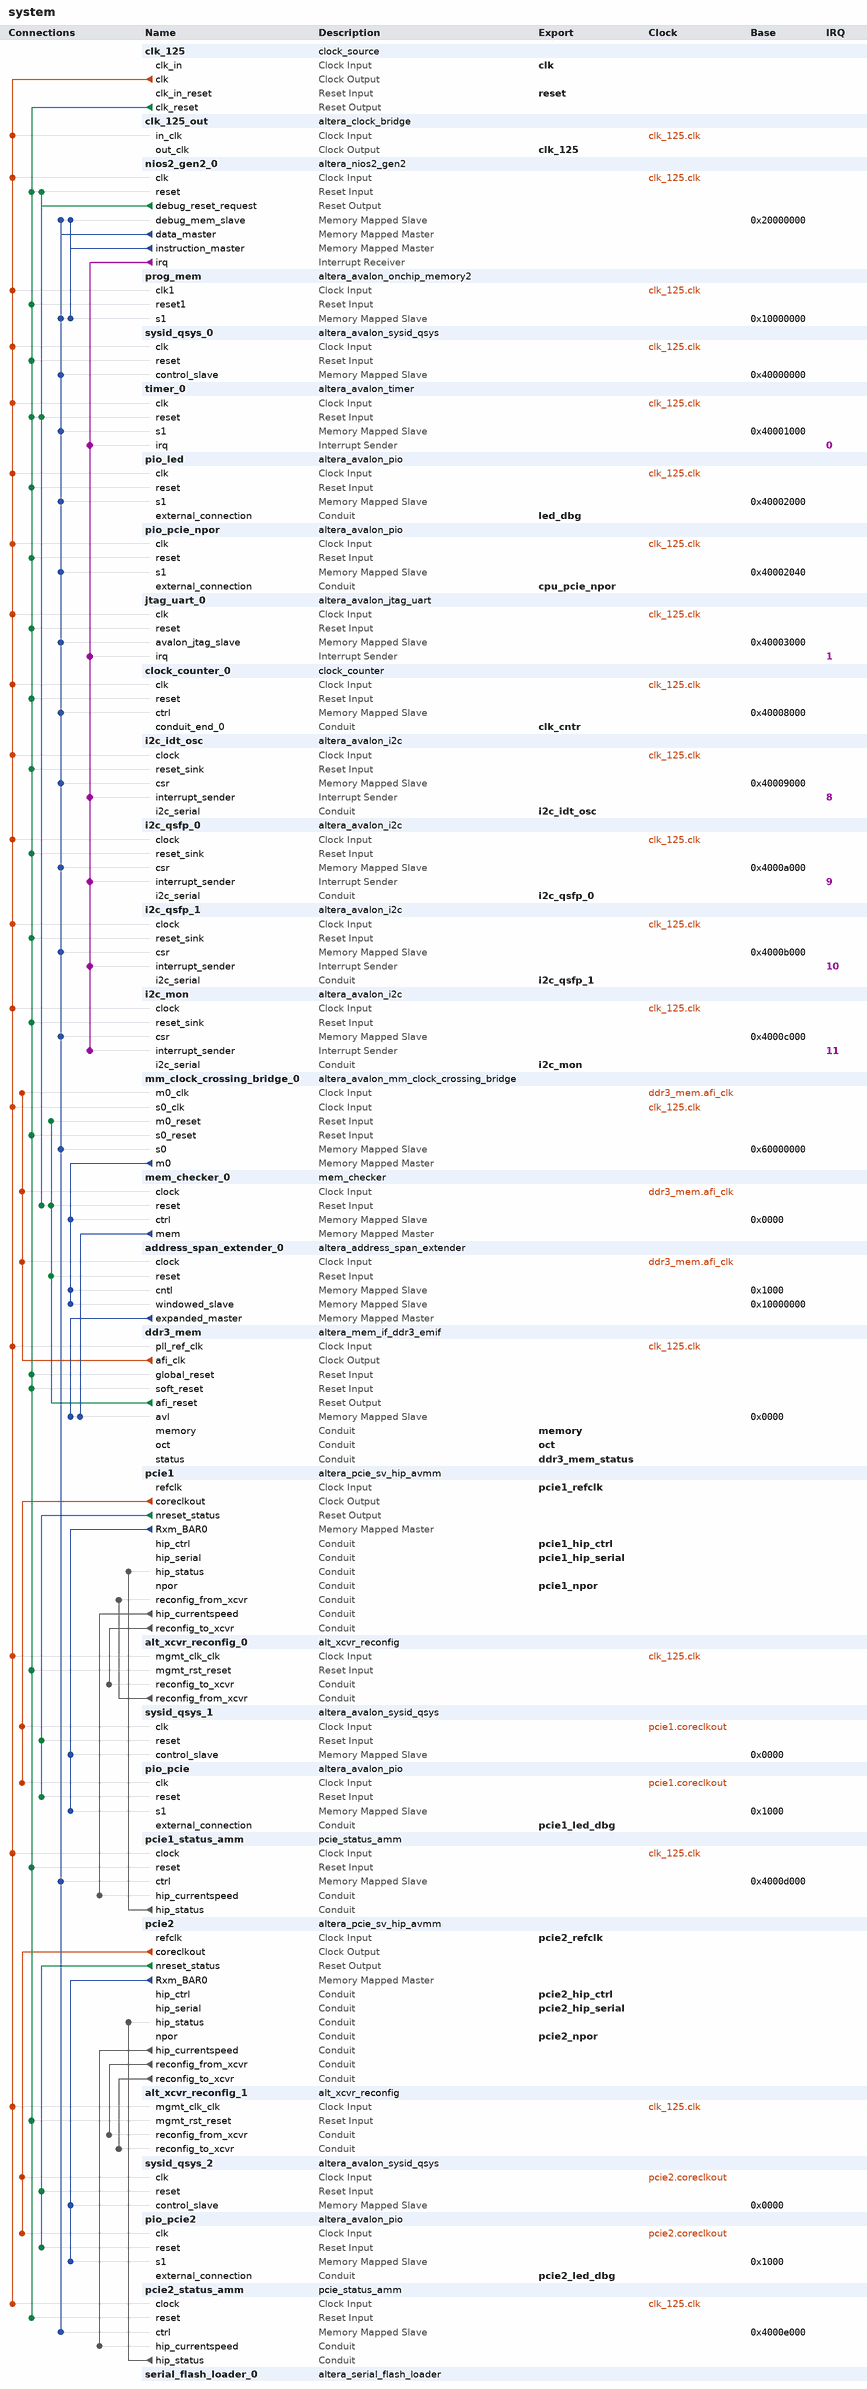
[diagram p0: system contents]
# Platform Designer (Qsys) system system, Stratix V 5SGSMD5K1F40C1
# Parameters at their usual value, and those the tool derives, are not listed.
package require -exact qsys 18.1
create_system system
set_project_property DEVICE_FAMILY {Stratix V}
set_project_property DEVICE 5SGSMD5K1F40C1

add_instance clk_125 clock_source 18.1
set_instance_parameter_value clk_125 clockFrequency 125000000

add_instance clk_125_out altera_clock_bridge 18.1
set_instance_parameter_value clk_125_out DERIVED_CLOCK_RATE 125000000
set_instance_parameter_value clk_125_out EXPLICIT_CLOCK_RATE 0

add_instance nios2_gen2_0 altera_nios2_gen2 18.1
set_instance_parameter_value nios2_gen2_0 dcache_size 2048
set_instance_parameter_value nios2_gen2_0 exceptionSlave prog_mem.s1
set_instance_parameter_value nios2_gen2_0 icache_size 4096
set_instance_parameter_value nios2_gen2_0 impl Tiny
set_instance_parameter_value nios2_gen2_0 resetSlave prog_mem.s1

add_instance prog_mem altera_avalon_onchip_memory2 18.1
set_instance_parameter_value prog_mem dataWidth 32
set_instance_parameter_value prog_mem dualPort false
set_instance_parameter_value prog_mem initMemContent true
set_instance_parameter_value prog_mem initializationFileName onchip_mem.hex
set_instance_parameter_value prog_mem memorySize 98304

add_instance sysid_qsys_0 altera_avalon_sysid_qsys 18.1
set_instance_parameter_value sysid_qsys_0 id 121286663

add_instance timer_0 altera_avalon_timer 18.1
set_instance_parameter_value timer_0 period 1
set_instance_parameter_value timer_0 periodUnits MSEC

add_instance pio_led altera_avalon_pio 18.1
set_instance_parameter_value pio_led direction Output
set_instance_parameter_value pio_led width 2

add_instance pio_pcie_npor altera_avalon_pio 18.1
set_instance_parameter_value pio_pcie_npor direction Output
set_instance_parameter_value pio_pcie_npor resetValue 1
set_instance_parameter_value pio_pcie_npor width 1

add_instance jtag_uart_0 altera_avalon_jtag_uart 18.1
set_instance_parameter_value jtag_uart_0 simInteractiveOptions NO_INTERACTIVE_WINDOWS

add_instance clock_counter_0 clock_counter 1.0
set_instance_parameter_value clock_counter_0 CLK_FREQ 125000000

add_instance i2c_idt_osc altera_avalon_i2c 18.1
set_instance_parameter_value i2c_idt_osc FIFO_DEPTH 32

add_instance i2c_qsfp_0 altera_avalon_i2c 18.1
set_instance_parameter_value i2c_qsfp_0 FIFO_DEPTH 32

add_instance i2c_qsfp_1 altera_avalon_i2c 18.1
set_instance_parameter_value i2c_qsfp_1 FIFO_DEPTH 32

add_instance i2c_mon altera_avalon_i2c 18.1
set_instance_parameter_value i2c_mon FIFO_DEPTH 32

add_instance mm_clock_crossing_bridge_0 altera_avalon_mm_clock_crossing_bridge 18.1
set_instance_parameter_value mm_clock_crossing_bridge_0 ADDRESS_WIDTH 29
set_instance_parameter_value mm_clock_crossing_bridge_0 COMMAND_FIFO_DEPTH 4
set_instance_parameter_value mm_clock_crossing_bridge_0 DATA_WIDTH 32
set_instance_parameter_value mm_clock_crossing_bridge_0 MASTER_SYNC_DEPTH 2
set_instance_parameter_value mm_clock_crossing_bridge_0 MAX_BURST_SIZE 1
set_instance_parameter_value mm_clock_crossing_bridge_0 RESPONSE_FIFO_DEPTH 4
set_instance_parameter_value mm_clock_crossing_bridge_0 SLAVE_SYNC_DEPTH 2
set_instance_parameter_value mm_clock_crossing_bridge_0 USE_AUTO_ADDRESS_WIDTH 0

add_instance mem_checker_0 mem_checker 1.0

add_instance address_span_extender_0 altera_address_span_extender 18.1
set_instance_parameter_value address_span_extender_0 BURSTCOUNT_WIDTH 1
set_instance_parameter_value address_span_extender_0 DATA_WIDTH 512
set_instance_parameter_value address_span_extender_0 ENABLE_SLAVE_PORT true
set_instance_parameter_value address_span_extender_0 MASTER_ADDRESS_DEF 0
set_instance_parameter_value address_span_extender_0 MAX_PENDING_READS 1
set_instance_parameter_value address_span_extender_0 SLAVE_ADDRESS_WIDTH 22

add_instance ddr3_mem altera_mem_if_ddr3_emif 18.1
set_instance_parameter_value ddr3_mem AVL_MAX_SIZE 64
set_instance_parameter_value ddr3_mem CALIBRATION_MODE Quick
set_instance_parameter_value ddr3_mem CFG_REORDER_DATA false
set_instance_parameter_value ddr3_mem CPORT_TYPE_PORT Bidirectional,Bidirectional,Bidirectional,Bidirectional,Bidirectional,Bidirectional
set_instance_parameter_value ddr3_mem CTL_CSR_ENABLED true
set_instance_parameter_value ddr3_mem CTL_ECC_AUTO_CORRECTION_ENABLED true
set_instance_parameter_value ddr3_mem CTL_ECC_ENABLED true
set_instance_parameter_value ddr3_mem EXPORT_AFI_HALF_CLK false
set_instance_parameter_value ddr3_mem HARD_EMIF false
set_instance_parameter_value ddr3_mem MEM_BANKADDR_WIDTH 3
set_instance_parameter_value ddr3_mem MEM_CLK_FREQ 800.0
set_instance_parameter_value ddr3_mem MEM_CLK_FREQ_MAX 1066.667
set_instance_parameter_value ddr3_mem MEM_COL_ADDR_WIDTH 10
set_instance_parameter_value ddr3_mem MEM_DQ_WIDTH 72
set_instance_parameter_value ddr3_mem MEM_DRV_STR RZQ/6
set_instance_parameter_value ddr3_mem MEM_FORMAT DISCRETE
set_instance_parameter_value ddr3_mem MEM_ROW_ADDR_WIDTH 16
set_instance_parameter_value ddr3_mem MEM_RTT_NOM RZQ/4
set_instance_parameter_value ddr3_mem MEM_RTT_WR RZQ/2
set_instance_parameter_value ddr3_mem MEM_TCL 11
set_instance_parameter_value ddr3_mem MEM_TFAW_NS 30.0
set_instance_parameter_value ddr3_mem MEM_TRAS_NS 37.5
set_instance_parameter_value ddr3_mem MEM_TRCD_NS 13.75
set_instance_parameter_value ddr3_mem MEM_TRFC_NS 260.0
set_instance_parameter_value ddr3_mem MEM_TRP_NS 13.75
set_instance_parameter_value ddr3_mem MEM_TRRD_NS 6.25
set_instance_parameter_value ddr3_mem MEM_TRTP_NS 7.5
set_instance_parameter_value ddr3_mem MEM_TWTR 6
set_instance_parameter_value ddr3_mem MEM_VENDOR Hynix
set_instance_parameter_value ddr3_mem MEM_VOLTAGE {1.35V DDR3L}
set_instance_parameter_value ddr3_mem MEM_WTCL 8
set_instance_parameter_value ddr3_mem PLL_LOCATION Top_Bottom
set_instance_parameter_value ddr3_mem POWER_OF_TWO_BUS true
set_instance_parameter_value ddr3_mem PRIORITY_PORT 1,1,1,1,1,1
set_instance_parameter_value ddr3_mem RATE Quarter
set_instance_parameter_value ddr3_mem REF_CLK_FREQ 125.0
set_instance_parameter_value ddr3_mem SPEED_GRADE 2
set_instance_parameter_value ddr3_mem TIMING_BOARD_AC_SKEW 0.02
set_instance_parameter_value ddr3_mem TIMING_BOARD_AC_TO_CK_SKEW 0.0
set_instance_parameter_value ddr3_mem TIMING_BOARD_DQ_TO_DQS_SKEW 0.0
set_instance_parameter_value ddr3_mem TIMING_BOARD_MAX_CK_DELAY 0.6
set_instance_parameter_value ddr3_mem TIMING_BOARD_MAX_DQS_DELAY 0.6
set_instance_parameter_value ddr3_mem TIMING_BOARD_SKEW_BETWEEN_DQS 0.02
set_instance_parameter_value ddr3_mem TIMING_BOARD_SKEW_CKDQS_DIMM_MAX 0.01
set_instance_parameter_value ddr3_mem TIMING_BOARD_SKEW_CKDQS_DIMM_MIN -0.01
set_instance_parameter_value ddr3_mem TIMING_BOARD_SKEW_WITHIN_DQS 0.02
set_instance_parameter_value ddr3_mem TIMING_TDH 110
set_instance_parameter_value ddr3_mem TIMING_TDQSCK 225
set_instance_parameter_value ddr3_mem TIMING_TDQSQ 150
set_instance_parameter_value ddr3_mem TIMING_TDQSS 0.25
set_instance_parameter_value ddr3_mem TIMING_TDS 40
set_instance_parameter_value ddr3_mem TIMING_TDSH 0.2
set_instance_parameter_value ddr3_mem TIMING_TDSS 0.2
set_instance_parameter_value ddr3_mem TIMING_TIH 210
set_instance_parameter_value ddr3_mem TIMING_TIS 140
set_instance_parameter_value ddr3_mem TIMING_TQSH 0.4
set_instance_parameter_value ddr3_mem USER_DEBUG_LEVEL 1

add_instance pcie1 altera_pcie_sv_hip_avmm 18.1
set_instance_parameter_value pcie1 AST_LITE 0
set_instance_parameter_value pcie1 AVALON_ADDR_WIDTH 32
set_instance_parameter_value pcie1 AddressPage "0\\,1\\,2\\,3\\,4\\,5\\,6\\,7\\,8\\,9\\,10\\,11\\,12\\,13\\,14\\,15"
set_instance_parameter_value pcie1 BYPASSS_A2P_TRANSLATION 0
set_instance_parameter_value pcie1 CB_A2P_ADDR_MAP_FIXED_TABLE_0_HIGH 0
set_instance_parameter_value pcie1 CB_A2P_ADDR_MAP_FIXED_TABLE_0_LOW 0
set_instance_parameter_value pcie1 CB_A2P_ADDR_MAP_FIXED_TABLE_10_HIGH 0
set_instance_parameter_value pcie1 CB_A2P_ADDR_MAP_FIXED_TABLE_10_LOW 0
set_instance_parameter_value pcie1 CB_A2P_ADDR_MAP_FIXED_TABLE_11_HIGH 0
set_instance_parameter_value pcie1 CB_A2P_ADDR_MAP_FIXED_TABLE_11_LOW 0
set_instance_parameter_value pcie1 CB_A2P_ADDR_MAP_FIXED_TABLE_12_HIGH 0
set_instance_parameter_value pcie1 CB_A2P_ADDR_MAP_FIXED_TABLE_12_LOW 0
set_instance_parameter_value pcie1 CB_A2P_ADDR_MAP_FIXED_TABLE_13_HIGH 0
set_instance_parameter_value pcie1 CB_A2P_ADDR_MAP_FIXED_TABLE_13_LOW 0
set_instance_parameter_value pcie1 CB_A2P_ADDR_MAP_FIXED_TABLE_14_HIGH 0
set_instance_parameter_value pcie1 CB_A2P_ADDR_MAP_FIXED_TABLE_14_LOW 0
set_instance_parameter_value pcie1 CB_A2P_ADDR_MAP_FIXED_TABLE_15_HIGH 0
set_instance_parameter_value pcie1 CB_A2P_ADDR_MAP_FIXED_TABLE_15_LOW 0
set_instance_parameter_value pcie1 CB_A2P_ADDR_MAP_FIXED_TABLE_1_HIGH 0
set_instance_parameter_value pcie1 CB_A2P_ADDR_MAP_FIXED_TABLE_1_LOW 0
set_instance_parameter_value pcie1 CB_A2P_ADDR_MAP_FIXED_TABLE_2_HIGH 0
set_instance_parameter_value pcie1 CB_A2P_ADDR_MAP_FIXED_TABLE_2_LOW 0
set_instance_parameter_value pcie1 CB_A2P_ADDR_MAP_FIXED_TABLE_3_HIGH 0
set_instance_parameter_value pcie1 CB_A2P_ADDR_MAP_FIXED_TABLE_3_LOW 0
set_instance_parameter_value pcie1 CB_A2P_ADDR_MAP_FIXED_TABLE_4_HIGH 0
set_instance_parameter_value pcie1 CB_A2P_ADDR_MAP_FIXED_TABLE_4_LOW 0
set_instance_parameter_value pcie1 CB_A2P_ADDR_MAP_FIXED_TABLE_5_HIGH 0
set_instance_parameter_value pcie1 CB_A2P_ADDR_MAP_FIXED_TABLE_5_LOW 0
set_instance_parameter_value pcie1 CB_A2P_ADDR_MAP_FIXED_TABLE_6_HIGH 0
set_instance_parameter_value pcie1 CB_A2P_ADDR_MAP_FIXED_TABLE_6_LOW 0
set_instance_parameter_value pcie1 CB_A2P_ADDR_MAP_FIXED_TABLE_7_HIGH 0
set_instance_parameter_value pcie1 CB_A2P_ADDR_MAP_FIXED_TABLE_7_LOW 0
set_instance_parameter_value pcie1 CB_A2P_ADDR_MAP_FIXED_TABLE_8_HIGH 0
set_instance_parameter_value pcie1 CB_A2P_ADDR_MAP_FIXED_TABLE_8_LOW 0
set_instance_parameter_value pcie1 CB_A2P_ADDR_MAP_FIXED_TABLE_9_HIGH 0
set_instance_parameter_value pcie1 CB_A2P_ADDR_MAP_FIXED_TABLE_9_LOW 0
set_instance_parameter_value pcie1 CB_A2P_ADDR_MAP_IS_FIXED 0
set_instance_parameter_value pcie1 CB_A2P_ADDR_MAP_NUM_ENTRIES 2
set_instance_parameter_value pcie1 CB_A2P_ADDR_MAP_PASS_THRU_BITS 20
set_instance_parameter_value pcie1 CB_P2A_AVALON_ADDR_B0 0x00000000
set_instance_parameter_value pcie1 CB_P2A_AVALON_ADDR_B1 0x00000000
set_instance_parameter_value pcie1 CB_P2A_AVALON_ADDR_B2 0x00000000
set_instance_parameter_value pcie1 CB_P2A_AVALON_ADDR_B3 0x00000000
set_instance_parameter_value pcie1 CB_P2A_AVALON_ADDR_B4 0x00000000
set_instance_parameter_value pcie1 CB_P2A_AVALON_ADDR_B5 0x00000000
set_instance_parameter_value pcie1 CB_P2A_FIXED_AVALON_ADDR_B0 0
set_instance_parameter_value pcie1 CB_P2A_FIXED_AVALON_ADDR_B1 0
set_instance_parameter_value pcie1 CB_P2A_FIXED_AVALON_ADDR_B2 0
set_instance_parameter_value pcie1 CB_P2A_FIXED_AVALON_ADDR_B3 0
set_instance_parameter_value pcie1 CB_P2A_FIXED_AVALON_ADDR_B4 0
set_instance_parameter_value pcie1 CB_P2A_FIXED_AVALON_ADDR_B5 0
set_instance_parameter_value pcie1 CB_PCIE_MODE 1
set_instance_parameter_value pcie1 CB_PCIE_RX_LITE 0
set_instance_parameter_value pcie1 CB_RP_S_ADDR_WIDTH 32
set_instance_parameter_value pcie1 CG_COMMON_CLOCK_MODE 1
set_instance_parameter_value pcie1 CG_ENABLE_A2P_INTERRUPT 0
set_instance_parameter_value pcie1 CG_ENABLE_ADVANCED_INTERRUPT 0
set_instance_parameter_value pcie1 CG_ENABLE_HIP_STATUS 1
set_instance_parameter_value pcie1 CG_ENABLE_HIP_STATUS_EXTENSION 0
set_instance_parameter_value pcie1 CG_IMPL_CRA_AV_SLAVE_PORT 0
set_instance_parameter_value pcie1 CG_RXM_IRQ_NUM 16
set_instance_parameter_value pcie1 NUM_PREFETCH_MASTERS 1
set_instance_parameter_value pcie1 PCIeAddress31_0 "0x00000000\\,0x00000000\\,0x00000000\\,0x00000000\\,0x00000000\\,0x00000000\\,0x00000000\\,0x00000000\\,0x00000000\\,0x00000000\\,0x00000000\\,0x00000000\\,0x00000000\\,0x00000000\\,0x00000000\\,0x00000000"
set_instance_parameter_value pcie1 PCIeAddress63_32 "0x00000000\\,0x00000000\\,0x00000000\\,0x00000000\\,0x00000000\\,0x00000000\\,0x00000000\\,0x00000000\\,0x00000000\\,0x00000000\\,0x00000000\\,0x00000000\\,0x00000000\\,0x00000000\\,0x00000000\\,0x00000000"
set_instance_parameter_value pcie1 RXM_BEN_WIDTH 8
set_instance_parameter_value pcie1 RXM_DATA_WIDTH 64
set_instance_parameter_value pcie1 SLAVE_ADDRESS_MAP_0 13
set_instance_parameter_value pcie1 SLAVE_ADDRESS_MAP_1 0
set_instance_parameter_value pcie1 SLAVE_ADDRESS_MAP_2 0
set_instance_parameter_value pcie1 SLAVE_ADDRESS_MAP_3 0
set_instance_parameter_value pcie1 SLAVE_ADDRESS_MAP_4 0
set_instance_parameter_value pcie1 SLAVE_ADDRESS_MAP_5 0
set_instance_parameter_value pcie1 TX_S_ADDR_WIDTH 32
set_instance_parameter_value pcie1 advanced_default_hwtcl_atomic_malformed true
set_instance_parameter_value pcie1 advanced_default_hwtcl_atomic_op_completer_32bit false
set_instance_parameter_value pcie1 advanced_default_hwtcl_atomic_op_completer_64bit false
set_instance_parameter_value pcie1 advanced_default_hwtcl_atomic_op_routing false
set_instance_parameter_value pcie1 advanced_default_hwtcl_bridge_port_ssid_support false
set_instance_parameter_value pcie1 advanced_default_hwtcl_bridge_port_vga_enable false
set_instance_parameter_value pcie1 advanced_default_hwtcl_bypass_cdc false
set_instance_parameter_value pcie1 advanced_default_hwtcl_cas_completer_128bit false
set_instance_parameter_value pcie1 advanced_default_hwtcl_cdc_dummy_insert_limit 11
set_instance_parameter_value pcie1 advanced_default_hwtcl_d0_pme false
set_instance_parameter_value pcie1 advanced_default_hwtcl_d1_pme false
set_instance_parameter_value pcie1 advanced_default_hwtcl_d1_support false
set_instance_parameter_value pcie1 advanced_default_hwtcl_d2_pme false
set_instance_parameter_value pcie1 advanced_default_hwtcl_d2_support false
set_instance_parameter_value pcie1 advanced_default_hwtcl_d3_cold_pme false
set_instance_parameter_value pcie1 advanced_default_hwtcl_d3_hot_pme false
set_instance_parameter_value pcie1 advanced_default_hwtcl_data_pack_rx disable
set_instance_parameter_value pcie1 advanced_default_hwtcl_deskew_comma com_deskw
set_instance_parameter_value pcie1 advanced_default_hwtcl_device_number 0
set_instance_parameter_value pcie1 advanced_default_hwtcl_disable_link_x2_support false
set_instance_parameter_value pcie1 advanced_default_hwtcl_disable_snoop_packet false
set_instance_parameter_value pcie1 advanced_default_hwtcl_ei_delay_powerdown_count 10
set_instance_parameter_value pcie1 advanced_default_hwtcl_eie_before_nfts_count 4
set_instance_parameter_value pcie1 advanced_default_hwtcl_enable_adapter_half_rate_mode false
set_instance_parameter_value pcie1 advanced_default_hwtcl_enable_l1_aspm false
set_instance_parameter_value pcie1 advanced_default_hwtcl_enable_rx_buffer_checking false
set_instance_parameter_value pcie1 advanced_default_hwtcl_extended_format_field false
set_instance_parameter_value pcie1 advanced_default_hwtcl_extended_tag_reset false
set_instance_parameter_value pcie1 advanced_default_hwtcl_fc_init_timer 1024
set_instance_parameter_value pcie1 advanced_default_hwtcl_flow_control_timeout_count 200
set_instance_parameter_value pcie1 advanced_default_hwtcl_flow_control_update_count 30
set_instance_parameter_value pcie1 advanced_default_hwtcl_flr_capability false
set_instance_parameter_value pcie1 advanced_default_hwtcl_gen2_diffclock_nfts_count 255
set_instance_parameter_value pcie1 advanced_default_hwtcl_gen2_sameclock_nfts_count 255
set_instance_parameter_value pcie1 advanced_default_hwtcl_hot_plug_support 0
set_instance_parameter_value pcie1 advanced_default_hwtcl_interrupt_pin inta
set_instance_parameter_value pcie1 advanced_default_hwtcl_l01_entry_latency 31
set_instance_parameter_value pcie1 advanced_default_hwtcl_l0_exit_latency_diffclock 6
set_instance_parameter_value pcie1 advanced_default_hwtcl_l0_exit_latency_sameclock 6
set_instance_parameter_value pcie1 advanced_default_hwtcl_l1_exit_latency_diffclock 0
set_instance_parameter_value pcie1 advanced_default_hwtcl_l1_exit_latency_sameclock 0
set_instance_parameter_value pcie1 advanced_default_hwtcl_low_priority_vc single_vc
set_instance_parameter_value pcie1 advanced_default_hwtcl_ltr_mechanism false
set_instance_parameter_value pcie1 advanced_default_hwtcl_ltssm_1ms_timeout disable
set_instance_parameter_value pcie1 advanced_default_hwtcl_ltssm_freqlocked_check disable
set_instance_parameter_value pcie1 advanced_default_hwtcl_maximum_current 0
set_instance_parameter_value pcie1 advanced_default_hwtcl_no_command_completed false
set_instance_parameter_value pcie1 advanced_default_hwtcl_no_soft_reset false
set_instance_parameter_value pcie1 advanced_default_hwtcl_pclk_out_sel pclk
set_instance_parameter_value pcie1 advanced_default_hwtcl_pipex1_debug_sel disable
set_instance_parameter_value pcie1 advanced_default_hwtcl_register_pipe_signals false
set_instance_parameter_value pcie1 advanced_default_hwtcl_reserved_debug 0
set_instance_parameter_value pcie1 advanced_default_hwtcl_retry_buffer_last_active_address 2047
set_instance_parameter_value pcie1 advanced_default_hwtcl_rx_l0s_count_idl 0
set_instance_parameter_value pcie1 advanced_default_hwtcl_set_l0s 0
set_instance_parameter_value pcie1 advanced_default_hwtcl_skp_os_gen3_count 0
set_instance_parameter_value pcie1 advanced_default_hwtcl_skp_os_schedule_count 0
set_instance_parameter_value pcie1 advanced_default_hwtcl_ssid 0
set_instance_parameter_value pcie1 advanced_default_hwtcl_ssvid 0
set_instance_parameter_value pcie1 advanced_default_hwtcl_tph_completer false
set_instance_parameter_value pcie1 advanced_default_hwtcl_tx_cdc_almost_empty 5
set_instance_parameter_value pcie1 advanced_default_hwtcl_vc0_clk_enable true
set_instance_parameter_value pcie1 advanced_default_hwtcl_wrong_device_id disable
set_instance_parameter_value pcie1 advanced_default_parameter_override 0
set_instance_parameter_value pcie1 avmm_width_hwtcl 128
set_instance_parameter_value pcie1 bar0_type_hwtcl 2
set_instance_parameter_value pcie1 bar1_type_hwtcl 0
set_instance_parameter_value pcie1 bar2_type_hwtcl 0
set_instance_parameter_value pcie1 bar3_type_hwtcl 0
set_instance_parameter_value pcie1 bar4_type_hwtcl 0
set_instance_parameter_value pcie1 bar5_type_hwtcl 0
set_instance_parameter_value pcie1 bypass_tl false
set_instance_parameter_value pcie1 class_code_hwtcl 0
set_instance_parameter_value pcie1 completion_timeout_hwtcl ABCD
set_instance_parameter_value pcie1 device_id_hwtcl 167
set_instance_parameter_value pcie1 dll_active_report_support_hwtcl 0
set_instance_parameter_value pcie1 ecrc_check_capable_hwtcl 0
set_instance_parameter_value pcie1 ecrc_gen_capable_hwtcl 0
set_instance_parameter_value pcie1 enable_completion_timeout_disable_hwtcl 1
set_instance_parameter_value pcie1 enable_function_msix_support_hwtcl 0
set_instance_parameter_value pcie1 enable_pcisigtest_hwtcl 0
set_instance_parameter_value pcie1 enable_power_on_rst_pulse_hwtcl 0
set_instance_parameter_value pcie1 enable_slot_register_hwtcl 0
set_instance_parameter_value pcie1 enable_tl_only_sim_hwtcl 0
set_instance_parameter_value pcie1 endpoint_l0_latency_hwtcl 0
set_instance_parameter_value pcie1 endpoint_l1_latency_hwtcl 0
set_instance_parameter_value pcie1 expansion_base_address_register_hwtcl 0
set_instance_parameter_value pcie1 extend_tag_field_hwtcl 32
set_instance_parameter_value pcie1 fixed_address_mode 0
set_instance_parameter_value pcie1 force_hrc 0
set_instance_parameter_value pcie1 force_src 0
set_instance_parameter_value pcie1 gen123_lane_rate_mode_hwtcl {Gen2 (5.0 Gbps)}
set_instance_parameter_value pcie1 gen3_rxfreqlock_counter_hwtcl 0
set_instance_parameter_value pcie1 hip_reconfig_hwtcl 0
set_instance_parameter_value pcie1 hip_tag_checking_hwtcl 1
set_instance_parameter_value pcie1 hwtcl_override_g2_txvod 1
set_instance_parameter_value pcie1 in_cvp_mode_hwtcl 0
set_instance_parameter_value pcie1 io_window_addr_width_hwtcl 0
set_instance_parameter_value pcie1 lane_mask_hwtcl x8
set_instance_parameter_value pcie1 max_payload_size_hwtcl 128
set_instance_parameter_value pcie1 msi_64bit_addressing_capable_hwtcl true
set_instance_parameter_value pcie1 msi_masking_capable_hwtcl false
set_instance_parameter_value pcie1 msi_multi_message_capable_hwtcl 4
set_instance_parameter_value pcie1 msi_support_hwtcl true
set_instance_parameter_value pcie1 msix_pba_bir_hwtcl 0
set_instance_parameter_value pcie1 msix_pba_offset_hwtcl 0
set_instance_parameter_value pcie1 msix_table_bir_hwtcl 0
set_instance_parameter_value pcie1 msix_table_offset_hwtcl 0
set_instance_parameter_value pcie1 msix_table_size_hwtcl 0
set_instance_parameter_value pcie1 override_rxbuffer_cred_preset 0
set_instance_parameter_value pcie1 override_tbpartner_driver_setting_hwtcl 0
set_instance_parameter_value pcie1 pcie_inspector_hwtcl 0
set_instance_parameter_value pcie1 pcie_qsys 1
set_instance_parameter_value pcie1 pll_refclk_freq_hwtcl {100 MHz}
set_instance_parameter_value pcie1 port_link_number_hwtcl 1
set_instance_parameter_value pcie1 port_type_hwtcl {Native endpoint}
set_instance_parameter_value pcie1 prefetchable_mem_window_addr_width_hwtcl 0
set_instance_parameter_value pcie1 revision_id_hwtcl 1
set_instance_parameter_value pcie1 rpre_emph_a_val_hwtcl 9
set_instance_parameter_value pcie1 rpre_emph_b_val_hwtcl 0
set_instance_parameter_value pcie1 rpre_emph_c_val_hwtcl 16
set_instance_parameter_value pcie1 rpre_emph_d_val_hwtcl 13
set_instance_parameter_value pcie1 rpre_emph_e_val_hwtcl 5
set_instance_parameter_value pcie1 rvod_sel_a_val_hwtcl 42
set_instance_parameter_value pcie1 rvod_sel_b_val_hwtcl 38
set_instance_parameter_value pcie1 rvod_sel_c_val_hwtcl 38
set_instance_parameter_value pcie1 rvod_sel_d_val_hwtcl 43
set_instance_parameter_value pcie1 rvod_sel_e_val_hwtcl 15
set_instance_parameter_value pcie1 rxbuffer_rxreq_hwtcl Low
set_instance_parameter_value pcie1 serial_sim_hwtcl 1
set_instance_parameter_value pcie1 set_pld_clk_x1_625MHz_hwtcl 0
set_instance_parameter_value pcie1 slot_number_hwtcl 0
set_instance_parameter_value pcie1 slot_power_limit_hwtcl 0
set_instance_parameter_value pcie1 slot_power_scale_hwtcl 0
set_instance_parameter_value pcie1 slotclkcfg_hwtcl 1
set_instance_parameter_value pcie1 subsystem_device_id_hwtcl 1
set_instance_parameter_value pcie1 subsystem_vendor_id_hwtcl 418
set_instance_parameter_value pcie1 surprise_down_error_support_hwtcl 0
set_instance_parameter_value pcie1 tlp_insp_trg_dw0_hwtcl 2049
set_instance_parameter_value pcie1 tlp_insp_trg_dw1_hwtcl 0
set_instance_parameter_value pcie1 tlp_insp_trg_dw2_hwtcl 0
set_instance_parameter_value pcie1 tlp_insp_trg_dw3_hwtcl 0
set_instance_parameter_value pcie1 tlp_inspector_hwtcl 0
set_instance_parameter_value pcie1 tlp_inspector_use_signal_probe_hwtcl 0
set_instance_parameter_value pcie1 use_aer_hwtcl 1
set_instance_parameter_value pcie1 use_ast_parity 0
set_instance_parameter_value pcie1 use_atx_pll_hwtcl 0
set_instance_parameter_value pcie1 use_crc_forwarding_hwtcl 0
set_instance_parameter_value pcie1 use_cvp_update_core_pof_hwtcl 0
set_instance_parameter_value pcie1 use_rx_st_be_hwtcl 0
set_instance_parameter_value pcie1 user_id_hwtcl 0
set_instance_parameter_value pcie1 vendor_id_hwtcl 4466
set_instance_parameter_value pcie1 vsec_id_hwtcl 4466
set_instance_parameter_value pcie1 vsec_rev_hwtcl 0

add_instance alt_xcvr_reconfig_0 alt_xcvr_reconfig 18.1
set_instance_parameter_value alt_xcvr_reconfig_0 device_family {Stratix V}
set_instance_parameter_value alt_xcvr_reconfig_0 enable_adce 0
set_instance_parameter_value alt_xcvr_reconfig_0 enable_analog 0
set_instance_parameter_value alt_xcvr_reconfig_0 number_of_reconfig_interfaces 10

add_instance sysid_qsys_1 altera_avalon_sysid_qsys 18.1
set_instance_parameter_value sysid_qsys_1 id 27394049

add_instance pio_pcie altera_avalon_pio 18.1
set_instance_parameter_value pio_pcie direction Output
set_instance_parameter_value pio_pcie width 1

add_instance pcie1_status_amm pcie_status_amm 1.0

add_instance pcie2 altera_pcie_sv_hip_avmm 18.1
set_instance_parameter_value pcie2 AST_LITE 0
set_instance_parameter_value pcie2 AVALON_ADDR_WIDTH 32
set_instance_parameter_value pcie2 AddressPage "0\\,1\\,2\\,3\\,4\\,5\\,6\\,7\\,8\\,9\\,10\\,11\\,12\\,13\\,14\\,15"
set_instance_parameter_value pcie2 BYPASSS_A2P_TRANSLATION 0
set_instance_parameter_value pcie2 CB_A2P_ADDR_MAP_FIXED_TABLE_0_HIGH 0
set_instance_parameter_value pcie2 CB_A2P_ADDR_MAP_FIXED_TABLE_0_LOW 0
set_instance_parameter_value pcie2 CB_A2P_ADDR_MAP_FIXED_TABLE_10_HIGH 0
set_instance_parameter_value pcie2 CB_A2P_ADDR_MAP_FIXED_TABLE_10_LOW 0
set_instance_parameter_value pcie2 CB_A2P_ADDR_MAP_FIXED_TABLE_11_HIGH 0
set_instance_parameter_value pcie2 CB_A2P_ADDR_MAP_FIXED_TABLE_11_LOW 0
set_instance_parameter_value pcie2 CB_A2P_ADDR_MAP_FIXED_TABLE_12_HIGH 0
set_instance_parameter_value pcie2 CB_A2P_ADDR_MAP_FIXED_TABLE_12_LOW 0
set_instance_parameter_value pcie2 CB_A2P_ADDR_MAP_FIXED_TABLE_13_HIGH 0
set_instance_parameter_value pcie2 CB_A2P_ADDR_MAP_FIXED_TABLE_13_LOW 0
set_instance_parameter_value pcie2 CB_A2P_ADDR_MAP_FIXED_TABLE_14_HIGH 0
set_instance_parameter_value pcie2 CB_A2P_ADDR_MAP_FIXED_TABLE_14_LOW 0
set_instance_parameter_value pcie2 CB_A2P_ADDR_MAP_FIXED_TABLE_15_HIGH 0
set_instance_parameter_value pcie2 CB_A2P_ADDR_MAP_FIXED_TABLE_15_LOW 0
set_instance_parameter_value pcie2 CB_A2P_ADDR_MAP_FIXED_TABLE_1_HIGH 0
set_instance_parameter_value pcie2 CB_A2P_ADDR_MAP_FIXED_TABLE_1_LOW 0
set_instance_parameter_value pcie2 CB_A2P_ADDR_MAP_FIXED_TABLE_2_HIGH 0
set_instance_parameter_value pcie2 CB_A2P_ADDR_MAP_FIXED_TABLE_2_LOW 0
set_instance_parameter_value pcie2 CB_A2P_ADDR_MAP_FIXED_TABLE_3_HIGH 0
set_instance_parameter_value pcie2 CB_A2P_ADDR_MAP_FIXED_TABLE_3_LOW 0
set_instance_parameter_value pcie2 CB_A2P_ADDR_MAP_FIXED_TABLE_4_HIGH 0
set_instance_parameter_value pcie2 CB_A2P_ADDR_MAP_FIXED_TABLE_4_LOW 0
set_instance_parameter_value pcie2 CB_A2P_ADDR_MAP_FIXED_TABLE_5_HIGH 0
set_instance_parameter_value pcie2 CB_A2P_ADDR_MAP_FIXED_TABLE_5_LOW 0
set_instance_parameter_value pcie2 CB_A2P_ADDR_MAP_FIXED_TABLE_6_HIGH 0
set_instance_parameter_value pcie2 CB_A2P_ADDR_MAP_FIXED_TABLE_6_LOW 0
set_instance_parameter_value pcie2 CB_A2P_ADDR_MAP_FIXED_TABLE_7_HIGH 0
set_instance_parameter_value pcie2 CB_A2P_ADDR_MAP_FIXED_TABLE_7_LOW 0
set_instance_parameter_value pcie2 CB_A2P_ADDR_MAP_FIXED_TABLE_8_HIGH 0
set_instance_parameter_value pcie2 CB_A2P_ADDR_MAP_FIXED_TABLE_8_LOW 0
set_instance_parameter_value pcie2 CB_A2P_ADDR_MAP_FIXED_TABLE_9_HIGH 0
set_instance_parameter_value pcie2 CB_A2P_ADDR_MAP_FIXED_TABLE_9_LOW 0
set_instance_parameter_value pcie2 CB_A2P_ADDR_MAP_IS_FIXED 0
set_instance_parameter_value pcie2 CB_A2P_ADDR_MAP_NUM_ENTRIES 2
set_instance_parameter_value pcie2 CB_A2P_ADDR_MAP_PASS_THRU_BITS 20
set_instance_parameter_value pcie2 CB_P2A_AVALON_ADDR_B0 0x00000000
set_instance_parameter_value pcie2 CB_P2A_AVALON_ADDR_B1 0x00000000
set_instance_parameter_value pcie2 CB_P2A_AVALON_ADDR_B2 0x00000000
set_instance_parameter_value pcie2 CB_P2A_AVALON_ADDR_B3 0x00000000
set_instance_parameter_value pcie2 CB_P2A_AVALON_ADDR_B4 0x00000000
set_instance_parameter_value pcie2 CB_P2A_AVALON_ADDR_B5 0x00000000
set_instance_parameter_value pcie2 CB_P2A_FIXED_AVALON_ADDR_B0 0
set_instance_parameter_value pcie2 CB_P2A_FIXED_AVALON_ADDR_B1 0
set_instance_parameter_value pcie2 CB_P2A_FIXED_AVALON_ADDR_B2 0
set_instance_parameter_value pcie2 CB_P2A_FIXED_AVALON_ADDR_B3 0
set_instance_parameter_value pcie2 CB_P2A_FIXED_AVALON_ADDR_B4 0
set_instance_parameter_value pcie2 CB_P2A_FIXED_AVALON_ADDR_B5 0
set_instance_parameter_value pcie2 CB_PCIE_MODE 1
set_instance_parameter_value pcie2 CB_PCIE_RX_LITE 0
set_instance_parameter_value pcie2 CB_RP_S_ADDR_WIDTH 32
set_instance_parameter_value pcie2 CG_COMMON_CLOCK_MODE 1
set_instance_parameter_value pcie2 CG_ENABLE_A2P_INTERRUPT 0
set_instance_parameter_value pcie2 CG_ENABLE_ADVANCED_INTERRUPT 0
set_instance_parameter_value pcie2 CG_ENABLE_HIP_STATUS 1
set_instance_parameter_value pcie2 CG_ENABLE_HIP_STATUS_EXTENSION 0
set_instance_parameter_value pcie2 CG_IMPL_CRA_AV_SLAVE_PORT 0
set_instance_parameter_value pcie2 CG_RXM_IRQ_NUM 16
set_instance_parameter_value pcie2 NUM_PREFETCH_MASTERS 1
set_instance_parameter_value pcie2 PCIeAddress31_0 "0x00000000\\,0x00000000\\,0x00000000\\,0x00000000\\,0x00000000\\,0x00000000\\,0x00000000\\,0x00000000\\,0x00000000\\,0x00000000\\,0x00000000\\,0x00000000\\,0x00000000\\,0x00000000\\,0x00000000\\,0x00000000"
set_instance_parameter_value pcie2 PCIeAddress63_32 "0x00000000\\,0x00000000\\,0x00000000\\,0x00000000\\,0x00000000\\,0x00000000\\,0x00000000\\,0x00000000\\,0x00000000\\,0x00000000\\,0x00000000\\,0x00000000\\,0x00000000\\,0x00000000\\,0x00000000\\,0x00000000"
set_instance_parameter_value pcie2 RXM_BEN_WIDTH 8
set_instance_parameter_value pcie2 RXM_DATA_WIDTH 64
set_instance_parameter_value pcie2 SLAVE_ADDRESS_MAP_0 13
set_instance_parameter_value pcie2 SLAVE_ADDRESS_MAP_1 0
set_instance_parameter_value pcie2 SLAVE_ADDRESS_MAP_2 0
set_instance_parameter_value pcie2 SLAVE_ADDRESS_MAP_3 0
set_instance_parameter_value pcie2 SLAVE_ADDRESS_MAP_4 0
set_instance_parameter_value pcie2 SLAVE_ADDRESS_MAP_5 0
set_instance_parameter_value pcie2 TX_S_ADDR_WIDTH 32
set_instance_parameter_value pcie2 advanced_default_hwtcl_atomic_malformed true
set_instance_parameter_value pcie2 advanced_default_hwtcl_atomic_op_completer_32bit false
set_instance_parameter_value pcie2 advanced_default_hwtcl_atomic_op_completer_64bit false
set_instance_parameter_value pcie2 advanced_default_hwtcl_atomic_op_routing false
set_instance_parameter_value pcie2 advanced_default_hwtcl_bridge_port_ssid_support false
set_instance_parameter_value pcie2 advanced_default_hwtcl_bridge_port_vga_enable false
set_instance_parameter_value pcie2 advanced_default_hwtcl_bypass_cdc false
set_instance_parameter_value pcie2 advanced_default_hwtcl_cas_completer_128bit false
set_instance_parameter_value pcie2 advanced_default_hwtcl_cdc_dummy_insert_limit 11
set_instance_parameter_value pcie2 advanced_default_hwtcl_d0_pme false
set_instance_parameter_value pcie2 advanced_default_hwtcl_d1_pme false
set_instance_parameter_value pcie2 advanced_default_hwtcl_d1_support false
set_instance_parameter_value pcie2 advanced_default_hwtcl_d2_pme false
set_instance_parameter_value pcie2 advanced_default_hwtcl_d2_support false
set_instance_parameter_value pcie2 advanced_default_hwtcl_d3_cold_pme false
set_instance_parameter_value pcie2 advanced_default_hwtcl_d3_hot_pme false
set_instance_parameter_value pcie2 advanced_default_hwtcl_data_pack_rx disable
set_instance_parameter_value pcie2 advanced_default_hwtcl_deskew_comma com_deskw
set_instance_parameter_value pcie2 advanced_default_hwtcl_device_number 0
set_instance_parameter_value pcie2 advanced_default_hwtcl_disable_link_x2_support false
set_instance_parameter_value pcie2 advanced_default_hwtcl_disable_snoop_packet false
set_instance_parameter_value pcie2 advanced_default_hwtcl_ei_delay_powerdown_count 10
set_instance_parameter_value pcie2 advanced_default_hwtcl_eie_before_nfts_count 4
set_instance_parameter_value pcie2 advanced_default_hwtcl_enable_adapter_half_rate_mode false
set_instance_parameter_value pcie2 advanced_default_hwtcl_enable_l1_aspm false
set_instance_parameter_value pcie2 advanced_default_hwtcl_enable_rx_buffer_checking false
set_instance_parameter_value pcie2 advanced_default_hwtcl_extended_format_field false
set_instance_parameter_value pcie2 advanced_default_hwtcl_extended_tag_reset false
set_instance_parameter_value pcie2 advanced_default_hwtcl_fc_init_timer 1024
set_instance_parameter_value pcie2 advanced_default_hwtcl_flow_control_timeout_count 200
set_instance_parameter_value pcie2 advanced_default_hwtcl_flow_control_update_count 30
set_instance_parameter_value pcie2 advanced_default_hwtcl_flr_capability false
set_instance_parameter_value pcie2 advanced_default_hwtcl_gen2_diffclock_nfts_count 255
set_instance_parameter_value pcie2 advanced_default_hwtcl_gen2_sameclock_nfts_count 255
set_instance_parameter_value pcie2 advanced_default_hwtcl_hot_plug_support 0
set_instance_parameter_value pcie2 advanced_default_hwtcl_interrupt_pin inta
set_instance_parameter_value pcie2 advanced_default_hwtcl_l01_entry_latency 31
set_instance_parameter_value pcie2 advanced_default_hwtcl_l0_exit_latency_diffclock 6
set_instance_parameter_value pcie2 advanced_default_hwtcl_l0_exit_latency_sameclock 6
set_instance_parameter_value pcie2 advanced_default_hwtcl_l1_exit_latency_diffclock 0
set_instance_parameter_value pcie2 advanced_default_hwtcl_l1_exit_latency_sameclock 0
set_instance_parameter_value pcie2 advanced_default_hwtcl_low_priority_vc single_vc
set_instance_parameter_value pcie2 advanced_default_hwtcl_ltr_mechanism false
set_instance_parameter_value pcie2 advanced_default_hwtcl_ltssm_1ms_timeout disable
set_instance_parameter_value pcie2 advanced_default_hwtcl_ltssm_freqlocked_check disable
set_instance_parameter_value pcie2 advanced_default_hwtcl_maximum_current 0
set_instance_parameter_value pcie2 advanced_default_hwtcl_no_command_completed false
set_instance_parameter_value pcie2 advanced_default_hwtcl_no_soft_reset false
set_instance_parameter_value pcie2 advanced_default_hwtcl_pclk_out_sel pclk
set_instance_parameter_value pcie2 advanced_default_hwtcl_pipex1_debug_sel disable
set_instance_parameter_value pcie2 advanced_default_hwtcl_register_pipe_signals false
set_instance_parameter_value pcie2 advanced_default_hwtcl_reserved_debug 0
set_instance_parameter_value pcie2 advanced_default_hwtcl_retry_buffer_last_active_address 2047
set_instance_parameter_value pcie2 advanced_default_hwtcl_rx_l0s_count_idl 0
set_instance_parameter_value pcie2 advanced_default_hwtcl_set_l0s 0
set_instance_parameter_value pcie2 advanced_default_hwtcl_skp_os_gen3_count 0
set_instance_parameter_value pcie2 advanced_default_hwtcl_skp_os_schedule_count 0
set_instance_parameter_value pcie2 advanced_default_hwtcl_ssid 0
set_instance_parameter_value pcie2 advanced_default_hwtcl_ssvid 0
set_instance_parameter_value pcie2 advanced_default_hwtcl_tph_completer false
set_instance_parameter_value pcie2 advanced_default_hwtcl_tx_cdc_almost_empty 5
set_instance_parameter_value pcie2 advanced_default_hwtcl_vc0_clk_enable true
set_instance_parameter_value pcie2 advanced_default_hwtcl_wrong_device_id disable
set_instance_parameter_value pcie2 advanced_default_parameter_override 0
set_instance_parameter_value pcie2 avmm_width_hwtcl 128
set_instance_parameter_value pcie2 bar0_type_hwtcl 2
set_instance_parameter_value pcie2 bar1_type_hwtcl 0
set_instance_parameter_value pcie2 bar2_type_hwtcl 0
set_instance_parameter_value pcie2 bar3_type_hwtcl 0
set_instance_parameter_value pcie2 bar4_type_hwtcl 0
set_instance_parameter_value pcie2 bar5_type_hwtcl 0
set_instance_parameter_value pcie2 bypass_tl false
set_instance_parameter_value pcie2 class_code_hwtcl 0
set_instance_parameter_value pcie2 completion_timeout_hwtcl ABCD
set_instance_parameter_value pcie2 device_id_hwtcl 167
set_instance_parameter_value pcie2 dll_active_report_support_hwtcl 0
set_instance_parameter_value pcie2 ecrc_check_capable_hwtcl 0
set_instance_parameter_value pcie2 ecrc_gen_capable_hwtcl 0
set_instance_parameter_value pcie2 enable_completion_timeout_disable_hwtcl 1
set_instance_parameter_value pcie2 enable_function_msix_support_hwtcl 0
set_instance_parameter_value pcie2 enable_pcisigtest_hwtcl 0
set_instance_parameter_value pcie2 enable_power_on_rst_pulse_hwtcl 0
set_instance_parameter_value pcie2 enable_slot_register_hwtcl 0
set_instance_parameter_value pcie2 enable_tl_only_sim_hwtcl 0
set_instance_parameter_value pcie2 endpoint_l0_latency_hwtcl 0
set_instance_parameter_value pcie2 endpoint_l1_latency_hwtcl 0
set_instance_parameter_value pcie2 expansion_base_address_register_hwtcl 0
set_instance_parameter_value pcie2 extend_tag_field_hwtcl 32
set_instance_parameter_value pcie2 fixed_address_mode 0
set_instance_parameter_value pcie2 force_hrc 0
set_instance_parameter_value pcie2 force_src 0
set_instance_parameter_value pcie2 gen123_lane_rate_mode_hwtcl {Gen2 (5.0 Gbps)}
set_instance_parameter_value pcie2 gen3_rxfreqlock_counter_hwtcl 0
set_instance_parameter_value pcie2 hip_reconfig_hwtcl 0
set_instance_parameter_value pcie2 hip_tag_checking_hwtcl 1
set_instance_parameter_value pcie2 hwtcl_override_g2_txvod 1
set_instance_parameter_value pcie2 in_cvp_mode_hwtcl 0
set_instance_parameter_value pcie2 io_window_addr_width_hwtcl 0
set_instance_parameter_value pcie2 lane_mask_hwtcl x8
set_instance_parameter_value pcie2 max_payload_size_hwtcl 128
set_instance_parameter_value pcie2 msi_64bit_addressing_capable_hwtcl true
set_instance_parameter_value pcie2 msi_masking_capable_hwtcl false
set_instance_parameter_value pcie2 msi_multi_message_capable_hwtcl 4
set_instance_parameter_value pcie2 msi_support_hwtcl true
set_instance_parameter_value pcie2 msix_pba_bir_hwtcl 0
set_instance_parameter_value pcie2 msix_pba_offset_hwtcl 0
set_instance_parameter_value pcie2 msix_table_bir_hwtcl 0
set_instance_parameter_value pcie2 msix_table_offset_hwtcl 0
set_instance_parameter_value pcie2 msix_table_size_hwtcl 0
set_instance_parameter_value pcie2 override_rxbuffer_cred_preset 0
set_instance_parameter_value pcie2 override_tbpartner_driver_setting_hwtcl 0
set_instance_parameter_value pcie2 pcie_inspector_hwtcl 0
set_instance_parameter_value pcie2 pcie_qsys 1
set_instance_parameter_value pcie2 pll_refclk_freq_hwtcl {100 MHz}
set_instance_parameter_value pcie2 port_link_number_hwtcl 2
set_instance_parameter_value pcie2 port_type_hwtcl {Native endpoint}
set_instance_parameter_value pcie2 prefetchable_mem_window_addr_width_hwtcl 0
set_instance_parameter_value pcie2 revision_id_hwtcl 1
set_instance_parameter_value pcie2 rpre_emph_a_val_hwtcl 9
set_instance_parameter_value pcie2 rpre_emph_b_val_hwtcl 0
set_instance_parameter_value pcie2 rpre_emph_c_val_hwtcl 16
set_instance_parameter_value pcie2 rpre_emph_d_val_hwtcl 13
set_instance_parameter_value pcie2 rpre_emph_e_val_hwtcl 5
set_instance_parameter_value pcie2 rvod_sel_a_val_hwtcl 42
set_instance_parameter_value pcie2 rvod_sel_b_val_hwtcl 38
set_instance_parameter_value pcie2 rvod_sel_c_val_hwtcl 38
set_instance_parameter_value pcie2 rvod_sel_d_val_hwtcl 43
set_instance_parameter_value pcie2 rvod_sel_e_val_hwtcl 15
set_instance_parameter_value pcie2 rxbuffer_rxreq_hwtcl Low
set_instance_parameter_value pcie2 serial_sim_hwtcl 1
set_instance_parameter_value pcie2 set_pld_clk_x1_625MHz_hwtcl 0
set_instance_parameter_value pcie2 slot_number_hwtcl 0
set_instance_parameter_value pcie2 slot_power_limit_hwtcl 0
set_instance_parameter_value pcie2 slot_power_scale_hwtcl 0
set_instance_parameter_value pcie2 slotclkcfg_hwtcl 1
set_instance_parameter_value pcie2 subsystem_device_id_hwtcl 2
set_instance_parameter_value pcie2 subsystem_vendor_id_hwtcl 418
set_instance_parameter_value pcie2 surprise_down_error_support_hwtcl 0
set_instance_parameter_value pcie2 tlp_insp_trg_dw0_hwtcl 2049
set_instance_parameter_value pcie2 tlp_insp_trg_dw1_hwtcl 0
set_instance_parameter_value pcie2 tlp_insp_trg_dw2_hwtcl 0
set_instance_parameter_value pcie2 tlp_insp_trg_dw3_hwtcl 0
set_instance_parameter_value pcie2 tlp_inspector_hwtcl 0
set_instance_parameter_value pcie2 tlp_inspector_use_signal_probe_hwtcl 0
set_instance_parameter_value pcie2 use_aer_hwtcl 1
set_instance_parameter_value pcie2 use_ast_parity 0
set_instance_parameter_value pcie2 use_atx_pll_hwtcl 0
set_instance_parameter_value pcie2 use_crc_forwarding_hwtcl 0
set_instance_parameter_value pcie2 use_cvp_update_core_pof_hwtcl 0
set_instance_parameter_value pcie2 use_rx_st_be_hwtcl 0
set_instance_parameter_value pcie2 user_id_hwtcl 0
set_instance_parameter_value pcie2 vendor_id_hwtcl 4466
set_instance_parameter_value pcie2 vsec_id_hwtcl 4466
set_instance_parameter_value pcie2 vsec_rev_hwtcl 0

add_instance alt_xcvr_reconfig_1 alt_xcvr_reconfig 18.1
set_instance_parameter_value alt_xcvr_reconfig_1 device_family {Stratix V}
set_instance_parameter_value alt_xcvr_reconfig_1 enable_adce 0
set_instance_parameter_value alt_xcvr_reconfig_1 enable_analog 0
set_instance_parameter_value alt_xcvr_reconfig_1 number_of_reconfig_interfaces 10

add_instance sysid_qsys_2 altera_avalon_sysid_qsys 18.1
set_instance_parameter_value sysid_qsys_2 id 27394050

add_instance pio_pcie2 altera_avalon_pio 18.1
set_instance_parameter_value pio_pcie2 direction Output
set_instance_parameter_value pio_pcie2 width 1

add_instance pcie2_status_amm pcie_status_amm 1.0

add_instance serial_flash_loader_0 altera_serial_flash_loader 18.1
set_instance_parameter_value serial_flash_loader_0 ENHANCED_MODE true
set_instance_parameter_value serial_flash_loader_0 gui_shared_access false

# connections
add_connection clk_125.clk alt_xcvr_reconfig_0.mgmt_clk_clk clock
add_connection clk_125.clk alt_xcvr_reconfig_1.mgmt_clk_clk clock
add_connection clk_125.clk clk_125_out.in_clk clock
add_connection clk_125.clk clock_counter_0.clk clock
add_connection clk_125.clk ddr3_mem.pll_ref_clk clock
add_connection clk_125.clk i2c_idt_osc.clock clock
add_connection clk_125.clk i2c_mon.clock clock
add_connection clk_125.clk i2c_qsfp_0.clock clock
add_connection clk_125.clk i2c_qsfp_1.clock clock
add_connection clk_125.clk jtag_uart_0.clk clock
add_connection clk_125.clk mm_clock_crossing_bridge_0.s0_clk clock
add_connection clk_125.clk nios2_gen2_0.clk clock
add_connection clk_125.clk pcie1_status_amm.clock clock
add_connection clk_125.clk pcie2_status_amm.clock clock
add_connection clk_125.clk pio_led.clk clock
add_connection clk_125.clk pio_pcie_npor.clk clock
add_connection clk_125.clk prog_mem.clk1 clock
add_connection clk_125.clk sysid_qsys_0.clk clock
add_connection clk_125.clk timer_0.clk clock
add_connection ddr3_mem.afi_clk address_span_extender_0.clock clock
add_connection ddr3_mem.afi_clk mem_checker_0.clock clock
add_connection ddr3_mem.afi_clk mm_clock_crossing_bridge_0.m0_clk clock
add_connection pcie1.coreclkout pio_pcie.clk clock
add_connection pcie1.coreclkout sysid_qsys_1.clk clock
add_connection pcie2.coreclkout pio_pcie2.clk clock
add_connection pcie2.coreclkout sysid_qsys_2.clk clock
add_connection clk_125.clk_reset alt_xcvr_reconfig_0.mgmt_rst_reset reset
add_connection clk_125.clk_reset alt_xcvr_reconfig_1.mgmt_rst_reset reset
add_connection clk_125.clk_reset clock_counter_0.reset reset
add_connection clk_125.clk_reset ddr3_mem.global_reset reset
add_connection clk_125.clk_reset ddr3_mem.soft_reset reset
add_connection clk_125.clk_reset i2c_idt_osc.reset_sink reset
add_connection clk_125.clk_reset i2c_mon.reset_sink reset
add_connection clk_125.clk_reset i2c_qsfp_0.reset_sink reset
add_connection clk_125.clk_reset i2c_qsfp_1.reset_sink reset
add_connection clk_125.clk_reset jtag_uart_0.reset reset
add_connection clk_125.clk_reset mm_clock_crossing_bridge_0.s0_reset reset
add_connection clk_125.clk_reset nios2_gen2_0.reset reset
add_connection clk_125.clk_reset pcie1_status_amm.reset reset
add_connection clk_125.clk_reset pcie2_status_amm.reset reset
add_connection clk_125.clk_reset pio_led.reset reset
add_connection clk_125.clk_reset pio_pcie_npor.reset reset
add_connection clk_125.clk_reset prog_mem.reset1 reset
add_connection clk_125.clk_reset sysid_qsys_0.reset reset
add_connection clk_125.clk_reset timer_0.reset reset
add_connection ddr3_mem.afi_reset address_span_extender_0.reset reset
add_connection ddr3_mem.afi_reset mem_checker_0.reset reset
add_connection ddr3_mem.afi_reset mm_clock_crossing_bridge_0.m0_reset reset
add_connection nios2_gen2_0.debug_reset_request mem_checker_0.reset reset
add_connection nios2_gen2_0.debug_reset_request nios2_gen2_0.reset reset
add_connection nios2_gen2_0.debug_reset_request timer_0.reset reset
add_connection pcie1.nreset_status pio_pcie.reset reset
add_connection pcie1.nreset_status sysid_qsys_1.reset reset
add_connection pcie2.nreset_status pio_pcie2.reset reset
add_connection pcie2.nreset_status sysid_qsys_2.reset reset
add_connection address_span_extender_0.expanded_master ddr3_mem.avl avalon
set_connection_parameter_value address_span_extender_0.expanded_master/ddr3_mem.avl baseAddress 0x0000
add_connection mem_checker_0.mem ddr3_mem.avl avalon
set_connection_parameter_value mem_checker_0.mem/ddr3_mem.avl baseAddress 0x0000
add_connection mm_clock_crossing_bridge_0.m0 address_span_extender_0.cntl avalon
set_connection_parameter_value mm_clock_crossing_bridge_0.m0/address_span_extender_0.cntl baseAddress 0x1000
add_connection mm_clock_crossing_bridge_0.m0 address_span_extender_0.windowed_slave avalon
set_connection_parameter_value mm_clock_crossing_bridge_0.m0/address_span_extender_0.windowed_slave baseAddress 0x10000000
add_connection mm_clock_crossing_bridge_0.m0 mem_checker_0.ctrl avalon
set_connection_parameter_value mm_clock_crossing_bridge_0.m0/mem_checker_0.ctrl baseAddress 0x0000
add_connection nios2_gen2_0.data_master clock_counter_0.ctrl avalon
set_connection_parameter_value nios2_gen2_0.data_master/clock_counter_0.ctrl baseAddress 0x40008000
add_connection nios2_gen2_0.data_master i2c_idt_osc.csr avalon
set_connection_parameter_value nios2_gen2_0.data_master/i2c_idt_osc.csr baseAddress 0x40009000
add_connection nios2_gen2_0.data_master i2c_mon.csr avalon
set_connection_parameter_value nios2_gen2_0.data_master/i2c_mon.csr baseAddress 0x4000c000
add_connection nios2_gen2_0.data_master i2c_qsfp_0.csr avalon
set_connection_parameter_value nios2_gen2_0.data_master/i2c_qsfp_0.csr baseAddress 0x4000a000
add_connection nios2_gen2_0.data_master i2c_qsfp_1.csr avalon
set_connection_parameter_value nios2_gen2_0.data_master/i2c_qsfp_1.csr baseAddress 0x4000b000
add_connection nios2_gen2_0.data_master jtag_uart_0.avalon_jtag_slave avalon
set_connection_parameter_value nios2_gen2_0.data_master/jtag_uart_0.avalon_jtag_slave baseAddress 0x40003000
add_connection nios2_gen2_0.data_master mm_clock_crossing_bridge_0.s0 avalon
set_connection_parameter_value nios2_gen2_0.data_master/mm_clock_crossing_bridge_0.s0 baseAddress 0x60000000
add_connection nios2_gen2_0.data_master nios2_gen2_0.debug_mem_slave avalon
set_connection_parameter_value nios2_gen2_0.data_master/nios2_gen2_0.debug_mem_slave baseAddress 0x20000000
add_connection nios2_gen2_0.data_master pcie1_status_amm.ctrl avalon
set_connection_parameter_value nios2_gen2_0.data_master/pcie1_status_amm.ctrl baseAddress 0x4000d000
add_connection nios2_gen2_0.data_master pcie2_status_amm.ctrl avalon
set_connection_parameter_value nios2_gen2_0.data_master/pcie2_status_amm.ctrl baseAddress 0x4000e000
add_connection nios2_gen2_0.data_master pio_led.s1 avalon
set_connection_parameter_value nios2_gen2_0.data_master/pio_led.s1 baseAddress 0x40002000
add_connection nios2_gen2_0.data_master pio_pcie_npor.s1 avalon
set_connection_parameter_value nios2_gen2_0.data_master/pio_pcie_npor.s1 baseAddress 0x40002040
add_connection nios2_gen2_0.data_master prog_mem.s1 avalon
set_connection_parameter_value nios2_gen2_0.data_master/prog_mem.s1 baseAddress 0x10000000
add_connection nios2_gen2_0.data_master sysid_qsys_0.control_slave avalon
set_connection_parameter_value nios2_gen2_0.data_master/sysid_qsys_0.control_slave baseAddress 0x40000000
add_connection nios2_gen2_0.data_master timer_0.s1 avalon
set_connection_parameter_value nios2_gen2_0.data_master/timer_0.s1 baseAddress 0x40001000
add_connection nios2_gen2_0.instruction_master nios2_gen2_0.debug_mem_slave avalon
set_connection_parameter_value nios2_gen2_0.instruction_master/nios2_gen2_0.debug_mem_slave baseAddress 0x20000000
add_connection nios2_gen2_0.instruction_master prog_mem.s1 avalon
set_connection_parameter_value nios2_gen2_0.instruction_master/prog_mem.s1 baseAddress 0x10000000
add_connection pcie1.Rxm_BAR0 pio_pcie.s1 avalon
set_connection_parameter_value pcie1.Rxm_BAR0/pio_pcie.s1 baseAddress 0x1000
add_connection pcie1.Rxm_BAR0 sysid_qsys_1.control_slave avalon
set_connection_parameter_value pcie1.Rxm_BAR0/sysid_qsys_1.control_slave baseAddress 0x0000
add_connection pcie2.Rxm_BAR0 pio_pcie2.s1 avalon
set_connection_parameter_value pcie2.Rxm_BAR0/pio_pcie2.s1 baseAddress 0x1000
add_connection pcie2.Rxm_BAR0 sysid_qsys_2.control_slave avalon
set_connection_parameter_value pcie2.Rxm_BAR0/sysid_qsys_2.control_slave baseAddress 0x0000
add_connection alt_xcvr_reconfig_0.reconfig_from_xcvr pcie1.reconfig_from_xcvr conduit
add_connection pcie1.hip_currentspeed pcie1_status_amm.hip_currentspeed conduit
add_connection pcie1.reconfig_to_xcvr alt_xcvr_reconfig_0.reconfig_to_xcvr conduit
add_connection pcie1_status_amm.hip_status pcie1.hip_status conduit
add_connection pcie2.hip_currentspeed pcie2_status_amm.hip_currentspeed conduit
add_connection pcie2.reconfig_from_xcvr alt_xcvr_reconfig_1.reconfig_from_xcvr conduit
add_connection pcie2.reconfig_to_xcvr alt_xcvr_reconfig_1.reconfig_to_xcvr conduit
add_connection pcie2_status_amm.hip_status pcie2.hip_status conduit
add_connection nios2_gen2_0.irq i2c_idt_osc.interrupt_sender interrupt
set_connection_parameter_value nios2_gen2_0.irq/i2c_idt_osc.interrupt_sender irqNumber 8
add_connection nios2_gen2_0.irq i2c_mon.interrupt_sender interrupt
set_connection_parameter_value nios2_gen2_0.irq/i2c_mon.interrupt_sender irqNumber 11
add_connection nios2_gen2_0.irq i2c_qsfp_0.interrupt_sender interrupt
set_connection_parameter_value nios2_gen2_0.irq/i2c_qsfp_0.interrupt_sender irqNumber 9
add_connection nios2_gen2_0.irq i2c_qsfp_1.interrupt_sender interrupt
set_connection_parameter_value nios2_gen2_0.irq/i2c_qsfp_1.interrupt_sender irqNumber 10
add_connection nios2_gen2_0.irq jtag_uart_0.irq interrupt
set_connection_parameter_value nios2_gen2_0.irq/jtag_uart_0.irq irqNumber 1
add_connection nios2_gen2_0.irq timer_0.irq interrupt
